# Altium project Pixhack_V5_CORE.PrjPcb
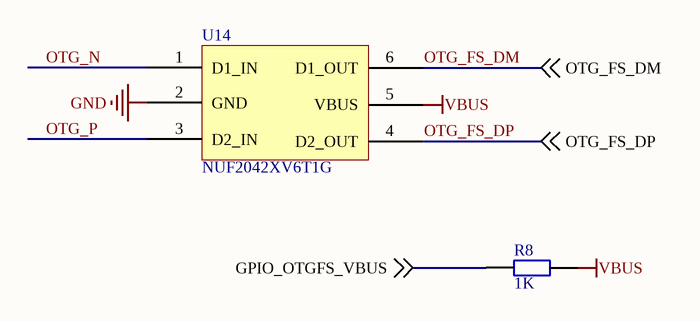
[diagram p0: 04_USB.SchDoc]
2 sheets, 7 parts. Net scope: global (net labels, ports and power ports of the same name join across sheets).
Board file: V5_CORE_V1.2.PcbDoc
Sheets:
  04_USB.SchDoc
  08_ONB_COMPASS.SchDoc

## Sheet 04_USB.SchDoc
size A4

### Parts
R8  1K  [0402R]
U14  NUF2042XV6T1G  [SOT563-6]

### Nets
GND: U14.2(GND)
VBUS: R8.2 U14.5(VBUS)
GPIO_OTGFS_VBUS: R8.1 ; off-sheet GPIO_OTGFS_VBUS
OTG_FS_DM: U14.6(D1_OUT) ; off-sheet OTG_FS_DM
OTG_FS_DP: U14.4(D2_OUT) ; off-sheet OTG_FS_DP
OTG_N: U14.1(D1_IN)
OTG_P: U14.3(D2_IN)

### Library data of the parts
R8 = 0402R10K: 0402R10K 1%

## Sheet 08_ONB_COMPASS.SchDoc
size A4
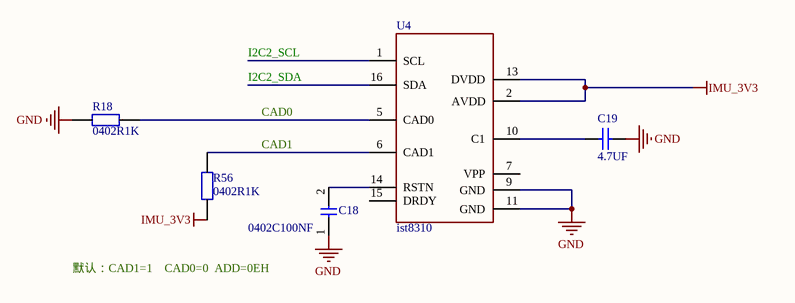
[diagram p1: 08_ONB_COMPASS.SchDoc]

### Parts
C18  0402C100NF  [0402C]
C19  4.7UF  [0805CAP]
R18  0402R1K  [0402R]
R56  0402R1K  [0402R]
U4  ist8310  [LGA16_4X4]

### Nets
GND: C18.1 C19.2 R18.2 U4.9(GND) U4.11(GND)
IMU_3V3: R56.1 U4.2(AVDD) U4.13(DVDD)
CAD0: R18.1 U4.5(CAD0)
CAD1: R56.2 U4.6(CAD1)
I2C2_SCL: U4.1(SCL)
I2C2_SDA: U4.16(SDA)
NetC18_2: C18.2 U4.14(RSTN)
NetC19_1: C19.1 U4.10(C1)

Not connected (* = marked no-connect by the designer): U4 7(VPP) 15(DRDY)

### Notes on the sheet
- Labels drawn without touching a wire or pin: 默认：CAD1=1    CAD0=0  ADD=0EH

### Library data of the parts
C18 = 0402C100NF: 50V 5%
C19 = Cap: Capacitor
R18 R56 = 0402R1K: 0402R1K 1%

## Nets that join several sheets
GND: 04_USB (U14.2), 08_ONB_COMPASS (5 pins)